# EAGLE design Wireach internal Buffered (EAGLE 7.2.0)
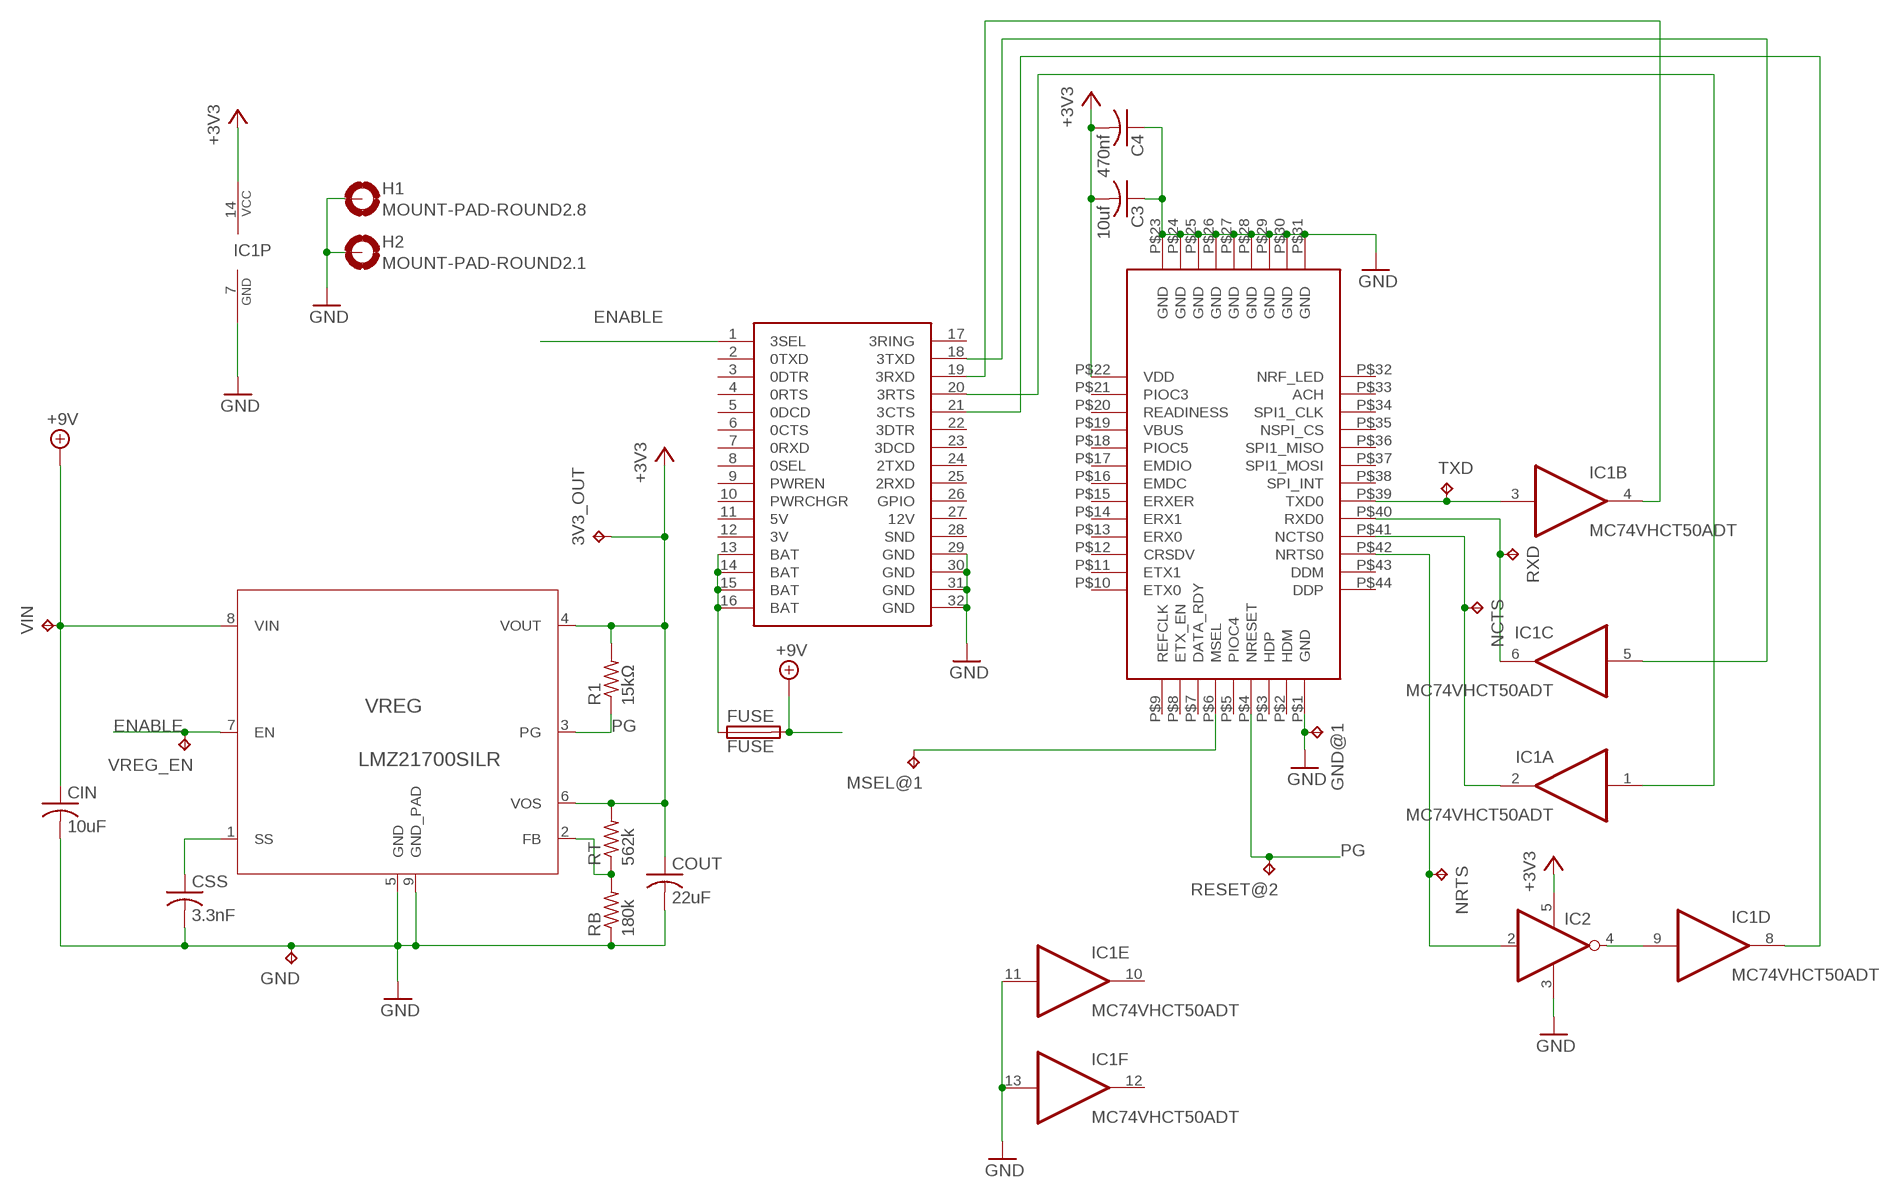
[diagram p0: schematic, sheet 1]

## Parts
3V3_OUT  TPTP10R  [TP10R]
C3  10uf  C-USC0805  [C0805]
C4  470nf  C-USC0805  [C0805]
CIN  10uF  C-USC0805K  [C0805K]
COUT  22uF  C-USC0805K  [C0805K]
CSS  3.3nF  C-USC0603K  [C0603K]
FUSE  FUSE  [R1206]
GND  TPTP10R  [TP10R]
GND@1  TPTP10R  [TP10R]
H1  MOUNT-PAD-ROUND2.8  [2,8-PAD]
H2  MOUNT-PAD-ROUND2.1  [2,1-PAD]
IC1  MC74VHCT50ADT  [TSSOP14]
IC2  1G04-DC  [SOT353/5]
MSEL@1  TPTP10R  [TP10R]
NCTS  TPTP10R  [TP10R]
NRTS  TPTP10R  [TP10R]
R1  15kΩ  R-US_R0603  [R0603]
RB  180k  R-US_R0603  [R0603]
RESET@2  TPTP10R  [TP10R]
RT  562k  R-US_R0603  [R0603]
RXD  TPTP10R  [TP10R]
TXD  TPTP10R  [TP10R]
U$1  WIREACH  [WIREACH]
U$3  N2-INTOLD  [NEWTON]
VIN  TPTP10R  [TP10R]
VREG  LMZ21700SILR  [SIL0008B]
VREG_EN  TPTP10R  [TP10R]

## Nets
+3V3 [power]: 3V3_OUT.TP C3.2 C4.2 COUT.1 IC1.14(P:VCC) IC2.5(VDD) R1.2 RT.2 U$1.P$22(VDD) VREG.4(VOUT) VREG.6(VOS)
+9V [power]: CIN.1 FUSE.2 VIN.TP VREG.8(VIN)
ENABLE: U$3.1(3SEL) VREG.7(EN) VREG_EN.TP
GND [power]: C3.1 C4.1 CIN.2 COUT.2 CSS.2 GND.TP GND@1.TP H1.B2,8(MOUNT) H2.B2,8(MOUNT) IC1.7(P:GND) IC1.11(E:I) IC1.13(F:I) IC2.3(GND) RB.1 U$1.P$1(GND) U$1.P$23(GND) U$1.P$24(GND) U$1.P$25(GND) U$1.P$26(GND) U$1.P$27(GND) U$1.P$28(GND) U$1.P$29(GND) U$1.P$30(GND) U$1.P$31(GND) U$3.29(GND) U$3.30(GND) U$3.31(GND) U$3.32(GND) VREG.5(GND) VREG.9(GND_PAD)
N$1: RB.2 RT.1 VREG.2(FB)
N$2: CSS.1 VREG.1(SS)
N$3: IC1.9(D:I) IC2.4(O)
N$4: IC1.3(B:I) TXD.TP U$1.P$39(TXD0)
N$5: IC2.2(I) NRTS.TP U$1.P$42(NRTS0)
N$6 [power]: FUSE.1 U$3.13(BAT) U$3.14(BAT) U$3.15(BAT) U$3.16(BAT)
N$7: IC1.6(C:O) RXD.TP U$1.P$40(RXD0)
N$8: IC1.2(A:O) NCTS.TP U$1.P$41(NCTS0)
N$11: MSEL@1.TP U$1.P$6(MSEL)
NCTS: IC1.1(A:I) U$3.20(3RTS)
NRTS: IC1.8(D:O) U$3.21(3CTS)
PG: R1.1 RESET@2.TP U$1.P$4(NRESET) VREG.3(PG)
RXD: IC1.5(C:I) U$3.18(3TXD)
TXD: IC1.4(B:O) U$3.19(3RXD)
Unconnected: IC1.10(E:O) IC1.12(F:O) U$1.P$2(HDM) U$1.P$3(HDP) U$1.P$5(PIOC4) U$1.P$7(DATA_RDY) U$1.P$8(ETX_EN) U$1.P$9(REFCLK) U$1.P$10(ETX0) U$1.P$11(ETX1) U$1.P$12(CRSDV) U$1.P$13(ERX0) U$1.P$14(ERX1) U$1.P$15(ERXER) U$1.P$16(EMDC) U$1.P$17(EMDIO) U$1.P$18(PIOC5) U$1.P$19(VBUS) U$1.P$20(READINESS) U$1.P$21(PIOC3) U$1.P$32(NRF_LED) U$1.P$33(ACH) U$1.P$34(SPI1_CLK) U$1.P$35(NSPI_CS) U$1.P$36(SPI1_MISO) U$1.P$37(SPI1_MOSI) U$1.P$38(SPI_INT) U$1.P$43(DDM) U$1.P$44(DDP) U$3.2(0TXD) U$3.3(0DTR) U$3.4(0RTS) U$3.5(0DCD) U$3.6(0CTS) U$3.7(0RXD) U$3.8(0SEL) U$3.9(PWREN) U$3.10(PWRCHGR) U$3.11(5V) U$3.12(3V) U$3.17(3RING) U$3.22(3DTR) U$3.23(3DCD) U$3.24(2TXD) U$3.25(2RXD) U$3.26(GPIO) U$3.27(12V) U$3.28(SND)

## Library data of the parts
3V3_OUT GND GND@1 MSEL@1 NCTS NRTS RESET@2 RXD TXD VIN VREG_EN = testpad:TP: Test pad
C3 C4 CIN COUT CSS = rcl:C-US: CAPACITOR, American symbol
FUSE = jblib:FUSE: Fuse
H1 = holes:MOUNT-PAD-ROUND: MOUNTING PAD, round
H2 = jblib:MOUNT-PAD-ROUND: MOUNTING PAD, round
IC1 = jblib:MC74VHCT50A: Noninverting Buffer / CMOS Logic Level Shifter
IC2 = picogate:1G04: Single Inverter
R1 = rcl:R-US_: RESISTOR, American symbol
RB RT = resistor:R-US_: RESISTOR, American symbol
U$1 = jblib:WIREACH
U$3 = jblib:N2-INT
VREG = LMZ21700:LMZ21700SILR; DATASHEETURL: http://www.ti.com/product/lmz21700; FREQUENCY: 2500000.0; IMAX: 0.65; MANUFACTURER_NAME: Texas Instruments; MANUFACTURER_PART_NUMBER: LMZ21700SILR; MKTG_PACKAGE: SYB08A; NSID: LMZ21700SYB/NOPB; PACKAGE: SYB08A; VENDOR: Texas Instruments

## Net classes
0 default: width 0.305 mm
1 power: width 0.305 mm

## Board
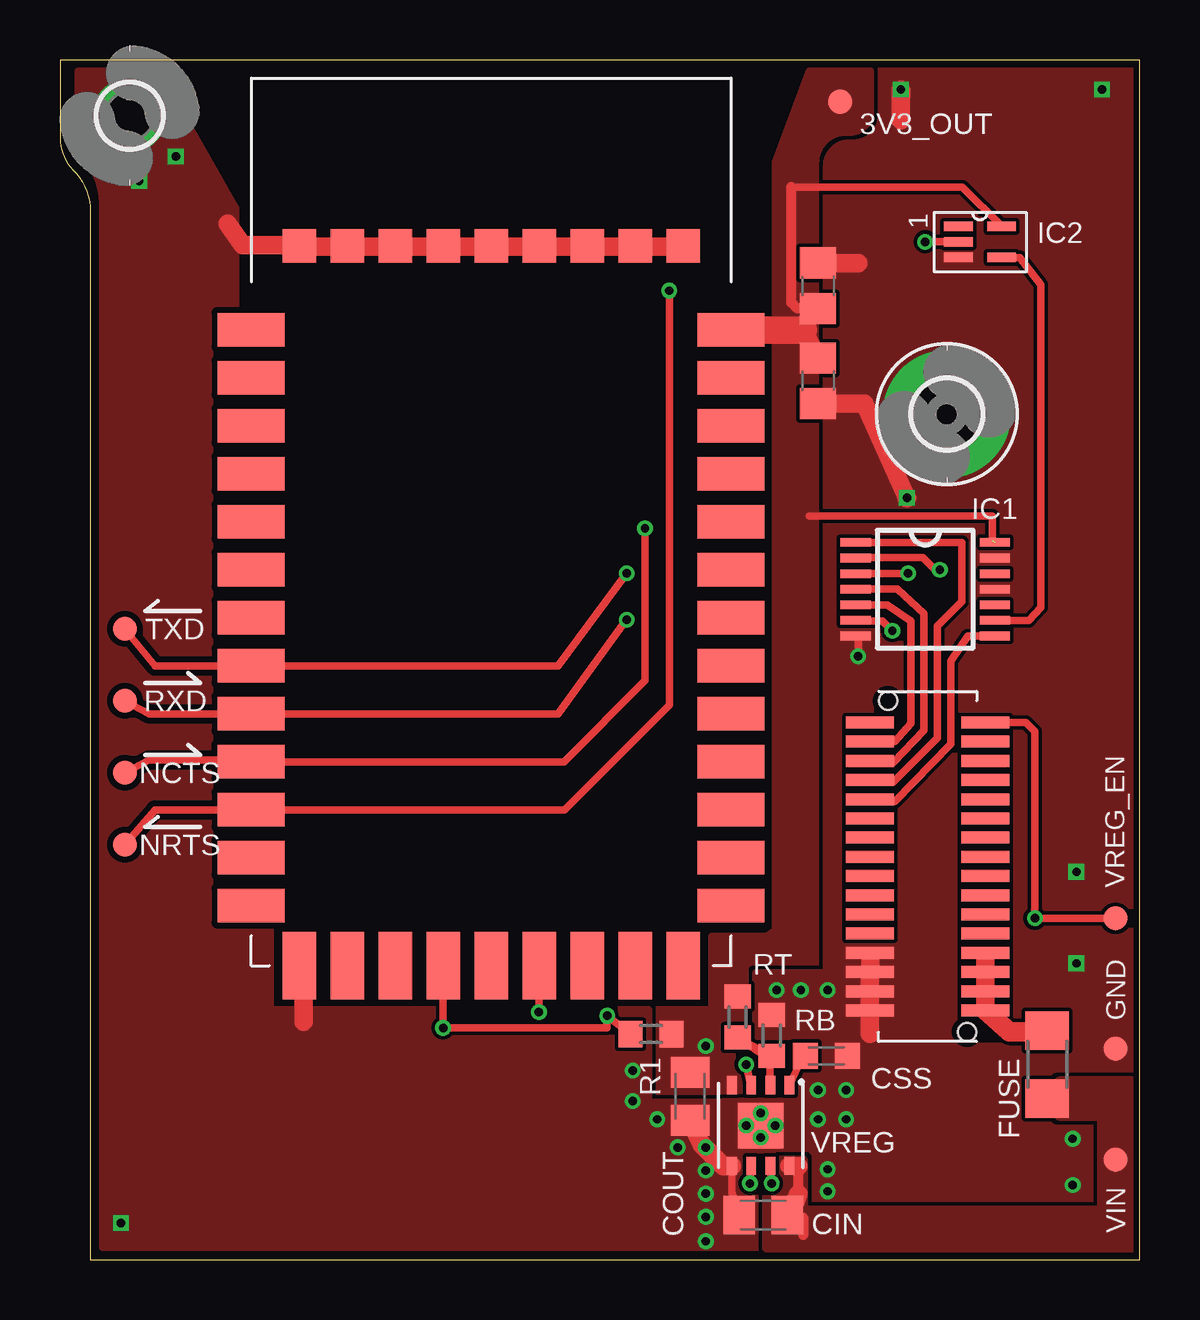
[diagram p1: board, top side]
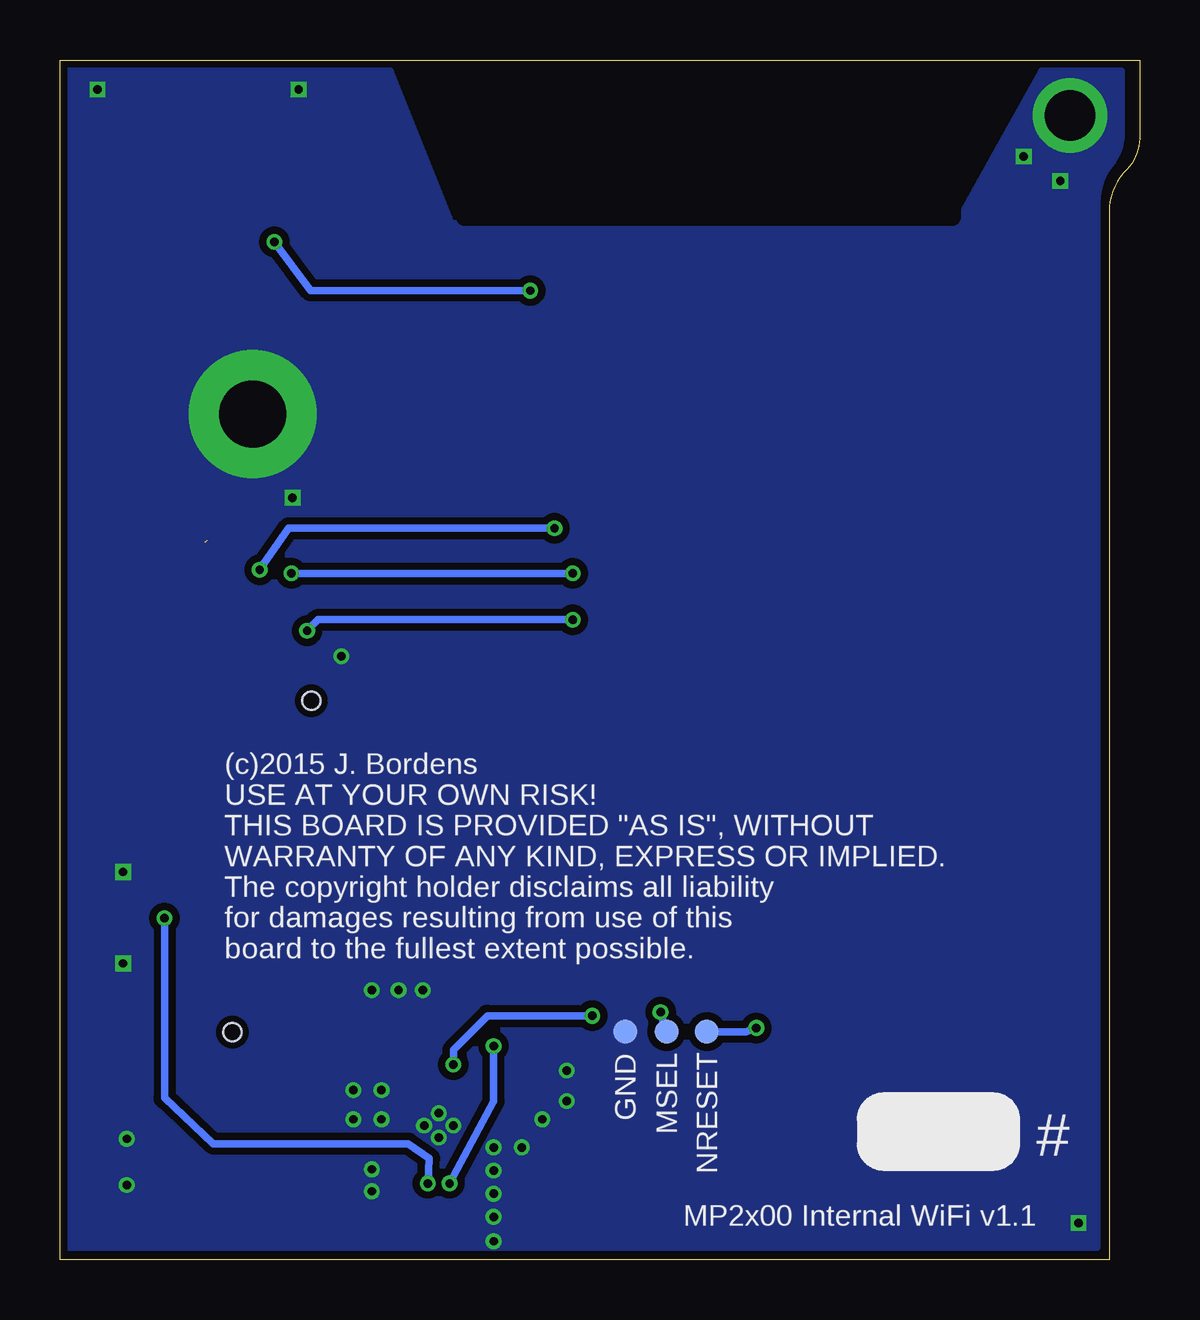
[diagram p2: board, bottom side, seen from below]

Size 45 x 50 mm. Coordinates in mm from the lower left corner, seen from the top.
Outline: 1.27,0 45,0 45,50 0,50 0,46.73 arc45 0.54,45.44 arc-45 1.27,43.67 1.27,0
Copper layers (1*16): Top 0.035mm / dielectric 1.5mm / Bottom 0.035mm
Design rules "ITEADstudio_DRC": minimum track width 6mil, minimum drill 12mil, track to track 6mil, track to pad 6mil, pad to pad 6mil, via to via 6mil, smd to smd 0mil, copper to edge 10mil, drill to drill 10mil, minimum pad ring 10mil, minimum via ring 6mil, stop-mask expansion 2mil, vias tented up to drill 100mil, thermal gap 10mil

### Footprints (pad centres in the part's own frame; a part is rotated, then mirrored left to right if it is on the bottom)
TP10R = smd 1 x 1: TP 0,0
C0805 = smd 1.3 x 1.5: 1 -0.95,0; 2 0.95,0
C0805K = smd 1.3 x 1.6: 1 -1,0; 2 1,0
C0603K = smd 1.05 x 1.08: 1 -0.875,0; 2 0.875,0
R1206 = smd 1.6 x 1.803: 1 -1.422,0; 2 1.422,0
2,8-PAD = drill 2.8 pad 5.334: B2,8 0,0
2,1-PAD = drill 2.1 pad 2.75: B2,8 0,0
TSSOP14 = smd 1.26 x 0.36: 1 -2.9,1.95; 2 -2.9,1.3; 3 -2.9,0.65; 4 -2.9,0; 5 -2.9,-0.65; 6 -2.9,-1.3; 7 -2.9,-1.95; 8 2.9,-1.95; 9 2.9,-1.3; 10 2.9,-0.65; 11 2.9,0; 12 2.9,0.65; 13 2.9,1.3; 14 2.9,1.95
SOT353/5 = smd 0.4 x 1.2: 1 -0.65,-0.9; 2 0,-0.9; 3 0.65,-0.9; 4 0.65,0.9; 5 -0.65,0.9
R0603 = smd 1 x 1.1: 1 -0.85,0; 2 0.85,0
WIREACH = smd 2.8 x 1.4: P$1 -18.5,8; P$2 -18.5,6; P$3 -18.5,4; P$4 -18.5,2; P$5 -18.5,0; P$6 -18.5,-2; P$7 -18.5,-4; P$8 -18.5,-6; P$9 -18.5,-8 | smd 1.4 x 2.8: P$10 -16,-10; P$11 -14,-10; P$12 -12,-10; P$13 -10,-10; P$14 -8,-10; P$15 -6,-10; P$16 -4,-10; P$17 -2,-10; P$18 0,-10; P$19 2,-10; P$20 4,-10; P$21 6,-10; P$22 8,-10; P$32 8,10; P$33 6,10; P$34 4,10; P$35 2,10; P$36 0,10; P$37 -2,10; P$38 -4,10; P$39 -6,10; P$40 -8,10; P$41 -10,10; P$42 -12,10; P$43 -14,10; P$44 -16,10 | smd 1.4 x 1.4: P$23 11.5,-8; P$24 11.5,-6; P$25 11.5,-4; P$26 11.5,-2; P$27 11.5,0; P$28 11.5,2; P$29 11.5,4; P$30 11.5,6; P$31 11.5,8
NEWTON = smd 2 x 0.5: 1 2.4,6; 2 2.4,5.2; 3 2.4,4.4; 4 2.4,3.6; 5 2.4,2.8; 6 2.4,2; 7 2.4,1.2; 8 2.4,0.4; 9 2.4,-0.4; 10 2.4,-1.2; 11 2.4,-2; 12 2.4,-2.8; 13 2.4,-3.6; 14 2.4,-4.4; 15 2.4,-5.2; 16 2.4,-6; 17 -2.4,6; 18 -2.4,5.2; 19 -2.4,4.4; 20 -2.4,3.6; 21 -2.4,2.8; 22 -2.4,2; 23 -2.4,1.2; 24 -2.4,0.4; 25 -2.4,-0.4; 26 -2.4,-1.2; 27 -2.4,-2; 28 -2.4,-2.8; 29 -2.4,-3.6; 30 -2.4,-4.4; 31 -2.4,-5.2; 32 -2.4,-6 | hole 0.75: -1.65,6.9; 1.65,-6.9
SIL0008B = smd 0.762 x 0.406: 1 -1.677,1.2; 2 -1.677,0.4; 3 -1.677,-0.4; 4 -1.677,-1.2; 5 1.677,-1.2; 6 1.677,-0.4; 7 1.677,0.4; 8 1.677,1.2 | smd 1.905 x 1.905: 9 0,0

### Placement (x,y rotation side)
3V3_OUT  32.51,48.26 0 top
C3  31.6,40.59 270 top
C4  31.6,36.63 90 top
CIN  29.31,1.85 180 top
COUT  26.26,6.81 270 top
CSS  31.95,8.48 0 top
FUSE  41.15,8.13 270 top
GND  44,8.79 0 top
GND@1  21.44,9.5 0 bottom
H1  36.97,35.23 0 top
H2  2.9,47.69 0 top
IC1  36.07,27.94 0 top
IC2  38.35,42.42 270 top
MSEL@1  19.71,9.5 90 bottom
NCTS  2.7,20.29 180 top
NRTS  2.7,17.29 180 top
R1  24.64,9.4 0 top
RB  29.67,9.35 270 top
RESET@2  18.03,9.5 90 bottom
RT  28.24,10.11 90 top
RXD  2.7,23.29 180 top
TXD  2.7,26.29 180 top
U$1  17.97,30.75 90 top
U$3  36.17,16.39 0 top
VIN  44,4.17 0 top
VREG  29.21,5.59 270 top
VREG_EN  44,14.22 0 top

### Tracks (layer width: path | path; a pad name or v marks a point on that pad's centre or on a via)
+3V3  (via drill 0.35)  (1 unrouted)
  Top 0.305: 28,7.06 VREG.4 28,7.32 27.99,7.32 | VREG.6 v28.76,3.17 | 38.86,29.97 38.86,30.99 31.24,30.99 | 30.48,44.7 37.62,44.7 IC2.5
  Top 0.406: 30.99,38.73 C3.2 30.72,39.64 30.48,39.88 30.48,44.7
  Top 0.762: 28.26,38.73 U$1.P$22 | 30.99,38.73 C4.2
  Top 1.143: 30.99,38.73 28.26,38.73
  Bottom 0.305: v28.76,3.17 26.92,6.6 v26.92,8.89
  pour Top (rank 3, no thermals): 24.89,6.6 24.89,10.41 27.18,10.41 27.18,13.46 29.46,13.46 29.82,13.72 29.82,45.72 31.24,49.53 33.78,49.53 33.78,48.01 arc-90 33.02,46.99 32.76,46.99 arc90 31.5,45.73 31.5,44.45 31.49,11.43 28.45,11.43 28.45,6.6
+9V
  Top 0.406: 30.77,2.74 30.77,3.89 | 30.63,2.38 CIN.1 | 30.58,1.75 30.99,1.75 30.99,1.02
  Top 0.762: 30.63,2.38 30.77,2.74 | 30.77,3.89 VREG.8 | 30.58,1.75 CIN.1
  pour Top (no thermals): 29.46,4.11 29.46,0.51 44.7,0.51 44.7,7.42 41.66,7.42 41.66,5.99 43.43,5.99 43.43,2.03 30.99,2.03 30.99,4.11
ENABLE  (via drill 0.35)
  Top 0.305: 38.73,22.35 U$3.1 40.26,22.39 40.64,22.01 v40.64,14.22 VREG_EN.TP | VREG.7 v29.66,3.17
  Bottom 0.305: v29.66,3.17 29.61,4.22 30.48,4.83 38.61,4.83 40.64,6.74 v40.64,14.22
GND  (via drill 0.35)
  Top 0.305: 28,3.89 28,2.81 28.18,2.12 CIN.2 | IC1.7 33.27,25.91 v33.27,25.15
  Top 0.381: 33.78,12.53 U$3.29
  Top 0.762: U$1.P$1 10.16,12.06 10.16,9.91 | U$1.P$23 25.72,42.23 24.13,42.23 U$1.P$24 23.81,42.23 22.23,42.23 U$1.P$25 21.91,42.23 20.32,42.23 U$1.P$26 19.68,42.23 18.1,42.23 U$1.P$27 17.78,42.23 16.19,42.23 U$1.P$28 15.88,42.23 14.29,42.23 U$1.P$29 13.97,42.23 12.38,42.23 U$1.P$30 11.75,42.23 10.16,42.23 U$1.P$31 9.84,42.29 7.62,42.29 6.99,43.18 | 33.78,12.53 33.78,11.94 U$3.30 U$3.31 U$3.32 33.77,9.4 | VREG.5 28,3.89 27.66,3.89 26.75,4.8 COUT.2 | C3.1 33.27,41.54 | 35.05,47.5 v35.05,48.77 | C4.1 33.53,35.68 v35.31,31.75
  other vias: 29.21,6.1 29.82,5.59 29.21,5.08 28.6,5.59 32.77,7.06 32,2.84 32,3.76 31.6,5.84 26.92,3.71 23.88,7.87 23.88,6.6 25.76,4.67 26.92,1.78 26.92,2.74 26.92,0.76 26.92,4.67 31.6,7.06 42.21,5.03 32.77,5.84 30.89,11.23 29.87,11.23 32,11.23 43.43,48.77 42.37,16.15 4.83,45.97 3.3,44.96 2.54,1.52 42.21,3.1 24.89,5.84 42.37,12.34
  pour Top (isolate 0.254, rank 2, no thermals): 1.23,45.64 arc-39 0.76,46.98 0.76,49.53 4.06,49.53 7.32,43.81 7.37,13.72 8.76,13.72 8.76,9.91 1.78,9.91 1.78,44.08 arc39
  pour Bottom (isolate 0.305, no thermals): 1.78,0.51 44.7,0.51 44.7,49.53 31.24,49.53 28.7,43.18 7.62,43.18 4.06,49.53 0.76,49.53 0.76,46.98 arc39 1.23,45.64 arc-39 1.78,44.08
  pour Top (rank 2, no thermals): 1.78,10.41 24.54,10.41 24.54,6.55 29.21,6.55 29.21,0.51 1.78,0.51
  pour Top (rank 2, no thermals): 26.42,5.84 26.42,4.06 28.19,4.06 28.19,4.57 28.96,4.57 29.21,4.32 29.21,0.51 44.7,0.51 44.7,8.89 34.29,8.89 34.29,12.95 32.46,12.95 32.46,11.94 29.01,11.94 29.01,6.6 27.69,6.6 27.69,5.84
  pour Top (rank 4, no thermals): 29.72,39.88 29.72,45.72 31.24,49.53 44.7,49.53 44.7,8.89 30.48,8.89 30.48,38.61
N$1
  Top 0.305: VREG.2 29.6,7.32 29.6,8.34 RT.1 29.72,8.46 29.5,8.46 RB.2
N$2
  Top 0.305: 30.89,8.34 CSS.1 30.92,8.38 VREG.1
N$3
  Top 0.305: IC2.4 40.02,41.77 40.89,40.64 40.89,27.18 40.39,26.64 IC1.9
N$4  (via drill 0.35)
  Top 0.305: v23.62,28.6 20.75,24.75 U$1.P$39 3.97,24.74 TXD.TP | IC1.3 33.2,28.6 v35.36,28.6
  Bottom 0.305: v35.36,28.6 v23.62,28.6
N$5  (via drill 0.35)
  Top 0.305: v25.4,40.39 25.4,23.11 21.04,18.75 U$1.P$42 3.97,18.75 NRTS.TP | v36.07,42.42 IC2.2
  Bottom 0.305: v25.4,40.39 34.54,40.39 v36.07,42.42
N$6
  Top 0.508: 38.57,12.47 U$3.13
  Top 0.762: U$3.16 U$3.15 U$3.14 38.57,12.47
  Top 0.813: U$3.16 39.57,9.5 41.15,9.5 FUSE.1
N$7  (via drill 0.35)
  Top 0.305: v23.62,26.67 20.75,22.75 U$1.P$40 3.71,22.75 RXD.TP | IC1.6 33.21,26.62 34.29,26.62 v34.7,26.21
  Bottom 0.305: v34.7,26.21 34.24,26.67 v23.62,26.67
N$8  (via drill 0.35)
  Top 0.305: v24.38,30.48 24.38,24.13 21.01,20.75 U$1.P$41 7.97,20.83 3.71,20.83 NCTS.TP | IC1.2 33.21,29.26 35.97,29.26 36.42,28.8 v36.68,28.75
  Bottom 0.305: v36.68,28.75 35.46,30.48 v24.38,30.48
N$11  (via drill 0.35)
  Top 0.305: U$1.P$6 v19.96,10.31
  Bottom 0.305: MSEL@1.TP v19.96,10.31
NCTS
  Top 0.305: 33.83,20 U$3.20 | 33.87,19.96 34.75,19.91 36.58,21.74 36.58,26.42 37.59,27.43 37.59,29.89 34.32,29.89 IC1.1
  Top 0.406: 33.83,20 33.87,19.96
NRTS
  Top 0.305: U$3.21 33.83,19.2 34.8,19.1 37.13,21.49 37.13,24.94 37.85,25.99 IC1.8
PG  (via drill 0.35)
  Top 0.305: VREG.3 v28.6,8.13 | R1.1 v22.81,10.16 22.81,9.65 v15.97,9.65 U$1.P$4
  Bottom 0.305: v28.6,8.13 28.6,8.74 27.18,10.16 v22.81,10.16 | v15.97,9.65 16.41,9.5 RESET@2.TP
RXD
  Top 0.305: 33.83,21.6 U$3.18 | 33.85,21.59 34.8,21.59 35.46,22.35 35.46,26.62 34.48,27.29 IC1.5
  Top 0.406: 33.83,21.6 33.85,21.59
TXD
  Top 0.305: 33.89,20.79 U$3.19 33.83,20.79 | 33.81,20.83 34.75,20.73 36.02,22.05 36.02,26.92 34.9,27.94 IC1.4
  Top 0.406: U$3.19 33.81,20.83

### Text on the board
bNames: (c)2015 J. Bordens / USE AT YOUR OWN RISK! / THIS BOARD IS PROVIDED "AS IS", WITHOUT / WARRANTY OF ANY KIND, EXPRESS OR IMPLIED. / The copyright holder disclaims all liability / for damages resulting from use of this / board to the fullest extent possible. | NRESET | MSEL | GND | # | MP2x00 Internal WiFi v1.1